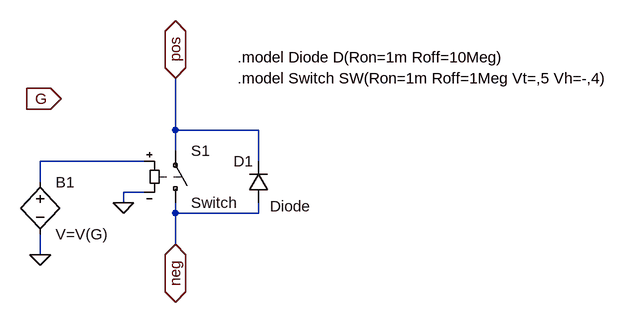
[diagram p0: schematic Ideal_Switch.asc]
Ideal_Switch.asc, the LTspice schematic file:
Version 4
SHEET 1 964 680
WIRE 240 112 240 32
WIRE 368 112 240 112
WIRE 240 144 240 112
WIRE 192 160 32 160
WIRE 368 160 368 112
WIRE 32 192 32 160
WIRE 192 208 160 208
WIRE 160 224 160 208
WIRE 240 240 240 224
WIRE 368 240 368 224
WIRE 368 240 240 240
WIRE 240 288 240 240
WIRE 32 304 32 272
FLAG 160 224 0
FLAG 32 304 0
FLAG 240 32 pos
IOPIN 240 32 BiDir
FLAG 240 288 neg
IOPIN 240 288 BiDir
FLAG 64 64 G
IOPIN 64 64 In
SYMBOL sw 240 240 M180
SYMATTR InstName Switch
SYMATTR Value S1
SYMBOL diode 384 224 R180
WINDOW 0 24 64 Left 2
WINDOW 3 -65 -5 Left 2
SYMATTR InstName D1
SYMATTR Value Diode
SYMBOL bv 32 176 R0
SYMATTR InstName B1
SYMATTR Value V=V(G)
TEXT 336 0 Left 2 !.model Diode D(Ron=1m Roff=10Meg)
TEXT 336 32 Left 2 !.model Switch SW(Ron=1m Roff=1Meg Vt=,5 Vh=-,4)

The netlist it stands for:
* Ideal_Switch.asc
Switch neg pos N001 0 S1
D1 neg pos Diode
B1 N001 0 V=V(G)
.model D D
.lib standard.dio
.model Diode D(Ron=1m Roff=10Meg)
.model Switch SW(Ron=1m Roff=1Meg Vt=,5 Vh=-,4)
.backanno
.end